# EAGLE design ir_amplifier (EAGLE 6.2)
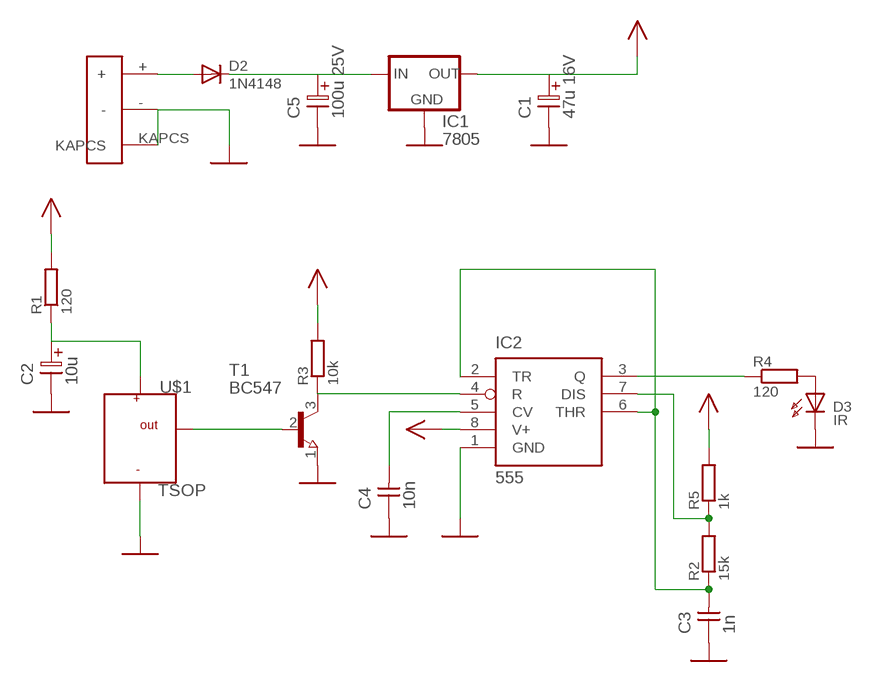
[diagram p0: schematic, sheet 1]

## Parts
C1  47u 16V  ELC-2,5L  [ES-2,5L]
C2  10u  ELC-2,5L  [ES-2,5L]
C3  1n  CAPNP-5  [C-5]
C4  10n  CAPNP-5  [C-5]
C5  100u 25V  ELC-5  [ES-5]
D2  1N4148  [DO35-10]
D3  IR  LED5  [LED5]
IC1  7805  78XXS  [78XXS]
IC2  555  [DIL8]
R1  120  0207/10  [0207/10]
R2  15k  0207/10  [0207/10]
R3  10k  0207/10  [0207/10]
R4  120  0207/10  [0207/10]
R5  1k  0207/10  [0207/10]
T1  BC547  [TO92]
U$1  TSOP  [TSOP]
U$2  DC ALJ  DC_ALJ  [DC_ALJ]

## Nets
GND: C1.2 C2.2 C3.1 C4.1 C5.2 D3.K IC1.GND IC2.1(GND) T1.1(E) U$1.- U$2.- U$2.KAPCS
N$1: C3.2 IC2.2(TR) IC2.6(THR) R2.1
N$2: IC2.3(Q) R4.1
N$4: C2.1 R1.1 U$1.+
N$5: D3.A R4.2
N$6: D2.A U$2.+
N$7: C5.1 D2.K IC1.IN
N$8: T1.2(B) U$1.OUT
N$10: IC2.4(R) R3.1 T1.3(C)
N$11: C4.2 IC2.5(CV)
N$12: IC2.7(DIS) R2.2 R5.1
VCC: C1.1 IC1.OUT IC2.8(V+) R1.2 R3.2 R5.2

## Library data of the parts
C1 C2 = discrete:ELC-2,5L
C3 C4 = discrete:CAPNP-5
C5 = discrete:ELC-5
D2 = diode:1N4148
D3 = led:LED5
IC1 = v-reg:78XXS
IC2 = titi:555
R1-R5 = r:0207/10
T1 = npn:BC547
U$1 = titi:TSOP
U$2 = titi:DC_ALJ

## Board
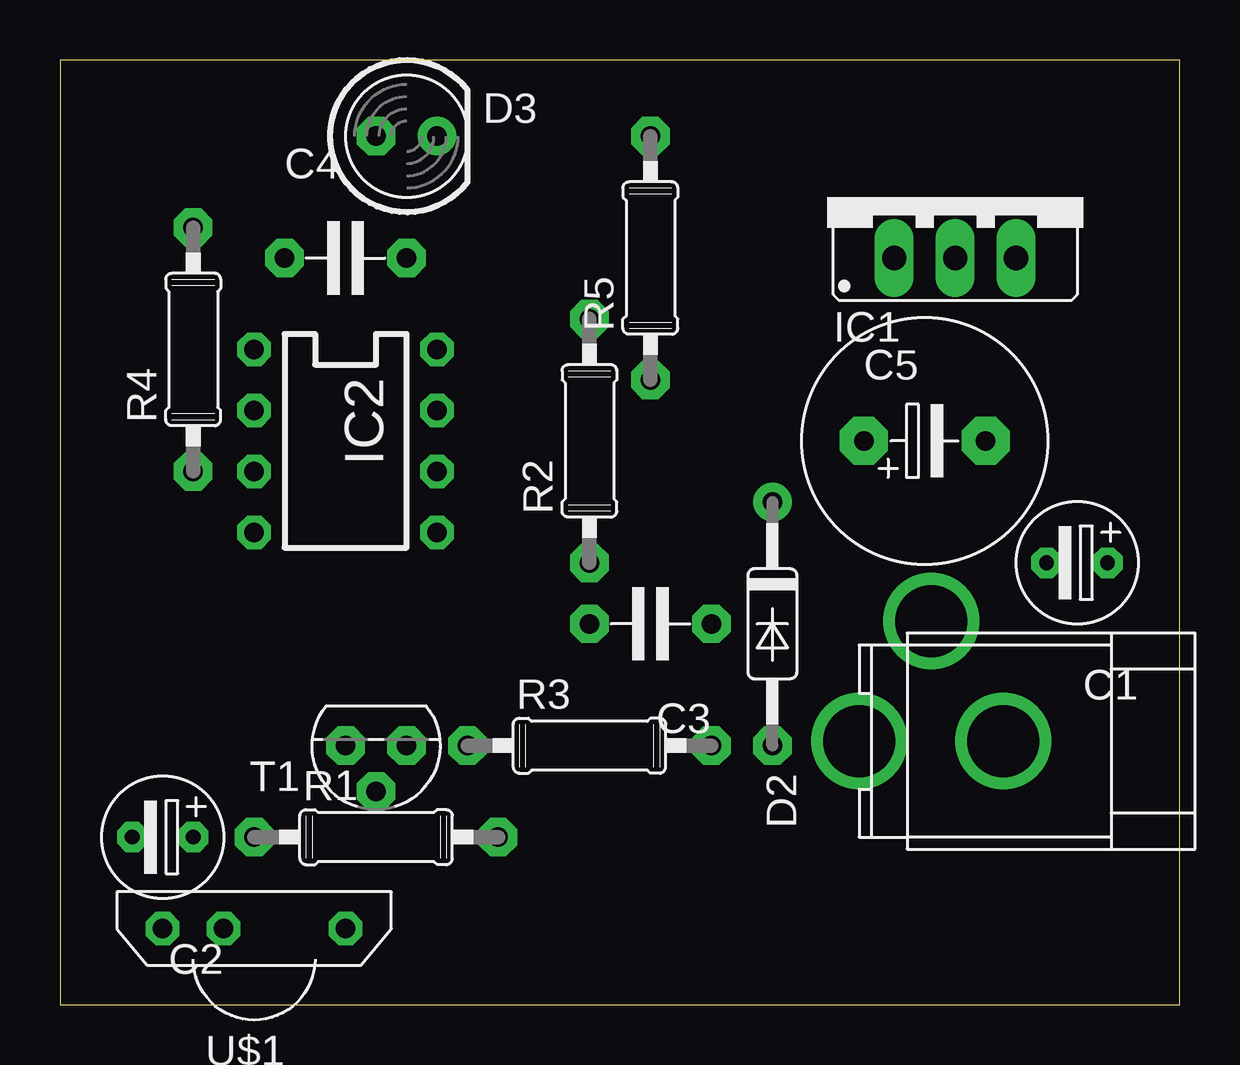
[diagram p1: board, top side]
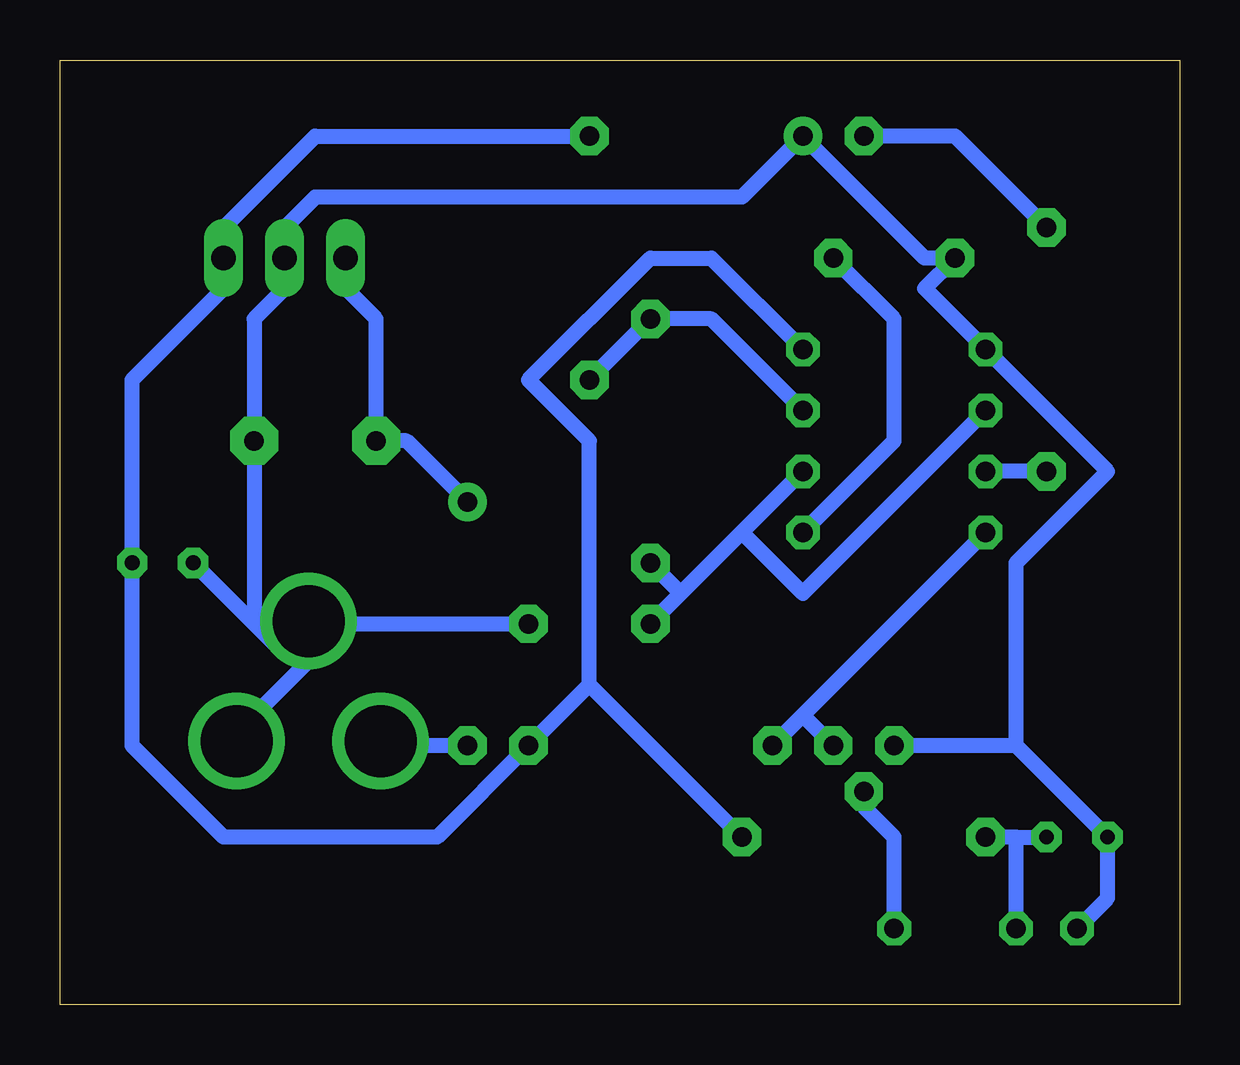
[diagram p2: board, bottom side, seen from below]

Size 46.66 x 39.36 mm. Coordinates in mm from the lower left corner, seen from the top.
Outline: 0,0 46.66,0 46.66,39.36 0,39.36 0,0
Copper layers 16: Bottom 0.035mm
Design rules: minimum track width 10mil, minimum drill 24mil, track to track 8mil, track to pad 8mil, pad to pad 8mil, via to via 8mil, smd to smd 8mil, copper to edge 40mil, drill to drill 8mil, minimum pad ring 10mil, minimum via ring 8mil, stop-mask expansion 4mil, vias tented up to drill 0mil, thermal gap 10mil

### Footprints (pad centres in the part's own frame; a part is rotated, then mirrored left to right if it is on the bottom)
ES-2,5L = drill 0.61 pad 1.27 octagon: 1 0,0; 2 2.54,0
C-5 = drill 0.813 pad 1.6 octagon: 1 -2.54,0; 2 2.54,0
ES-5 = drill 0.813 pad 2.007 octagon: 1 -2.54,0; 2 2.54,0
DO35-10 = drill 0.813 pad 1.6 octagon: A 5.08,0 | drill 0.813 pad 1.6: K -5.08,0
LED5 = drill 0.813 pad 1.6 octagon: A -1.27,0 | drill 0.813 pad 1.6: K 1.27,0
78XXS = drill 1.016 pad 1.626 long: GND 0,-2.54; IN -2.54,-2.54; OUT 2.54,-2.54
DIL8 = drill 0.813 pad 1.397 octagon: 1 -3.81,-3.81; 2 -1.27,-3.81; 3 1.27,-3.81; 4 3.81,-3.81; 5 3.81,3.81; 6 1.27,3.81; 7 -1.27,3.81; 8 -3.81,3.81
0207/10 = drill 0.813 pad 1.6 octagon: 1 -5.08,0; 2 5.08,0
TO92 = drill 0.813 pad 1.6 octagon: 1 1.27,0; 2 0,1.905; 3 -1.27,0
TSOP = drill 0.813 pad 1.397 octagon: + 0,0; - 2.54,0; OUT -5.08,0
DC_ALJ = drill 3 pad 4: + -6.54,-1.08; - -0.54,-1.08; KAPCS -3.54,3.92

### Placement (x,y rotation side)
C1  43.65,18.41 180 top
C2  5.55,6.98 180 top
C3  24.6,15.87 180 top
C4  11.9,31.11 0 top
C5  36.03,23.49 0 top
D2  29.68,15.87 270 top
D3  14.44,36.19 0 top
IC1  37.3,33.65 0 top
IC2  11.9,23.49 270 top
R1  13.17,6.98 0 top
R2  22.06,23.49 90 top
R3  22.06,10.79 0 top
R4  5.55,27.3 90 top
R5  24.6,31.11 90 top
T1  13.17,10.79 180 top
U$1  6.82,3.17 180 top
U$2  39.84,12.06 0 top

### Tracks (layer width: path | path; a pad name or v marks a point on that pad's centre or on a via)
GND
  Bottom 0.635: 38.57,15.87 37.3,14.6 U$2.KAPCS | 38.57,15.87 C1.2 | C3.1 34.76,15.87 U$2.KAPCS | 38.57,15.87 C5.2 38.57,28.57 37.3,29.84 IC1.GND 37.3,32.38 36.03,33.65 18.25,33.65 D3.K 10.63,31.11 C4.1 10.63,29.84 IC2.1 3.01,22.22 6.82,18.41 6.82,10.79 | U$2.- 38.57,12.06 36.03,14.6 U$2.KAPCS | U$1.- 3.01,4.44 C2.2 6.82,10.79 | 6.82,10.79 T1.1
N$1
  Bottom 0.635: 20.79,17.14 C3.2 | 18.25,19.68 20.79,17.14 | 18.25,19.68 IC2.6 | IC2.2 15.71,17.14 18.25,19.68 | 20.79,17.14 R2.1
N$2
  Bottom 0.635: R4.1 IC2.3
N$4
  Bottom 0.635: 6.82,6.98 R1.1 | 6.82,6.98 C2.1 | U$1.+ 6.82,6.98
N$5
  Bottom 0.635: R4.2 9.36,36.19 D3.A
N$6
  Bottom 0.635: D2.A 32.22,10.79 U$2.+
N$7
  Bottom 0.635: D2.K 32.22,23.49 C5.1 33.49,28.57 34.76,29.84 IC1.IN
N$8
  Bottom 0.635: U$1.OUT 11.9,6.98 13.17,8.25 T1.2
N$10
  Bottom 0.635: 15.71,12.06 R3.1 | 15.71,12.06 IC2.4 | T1.3 15.71,12.06
N$11
  Bottom 0.635: IC2.5 11.9,23.49 11.9,28.57 C4.2
N$12
  Bottom 0.635: IC2.7 19.52,28.57 R2.2 R5.1
VCC
  Bottom 0.635: IC2.8 19.52,31.11 22.06,31.11 27.14,26.03 24.6,23.49 24.6,13.33 | 24.6,13.33 R3.2 30.95,6.98 39.84,6.98 43.65,10.79 C1.1 43.65,26.03 39.84,29.84 IC1.OUT 39.84,32.38 36.03,36.19 R5.2 | R1.2 24.6,13.33